# Altium schematic sheet 03_DISCRETE_LNA.SchDoc
size A3; SheetNumber: 3; SheetTotal: 6
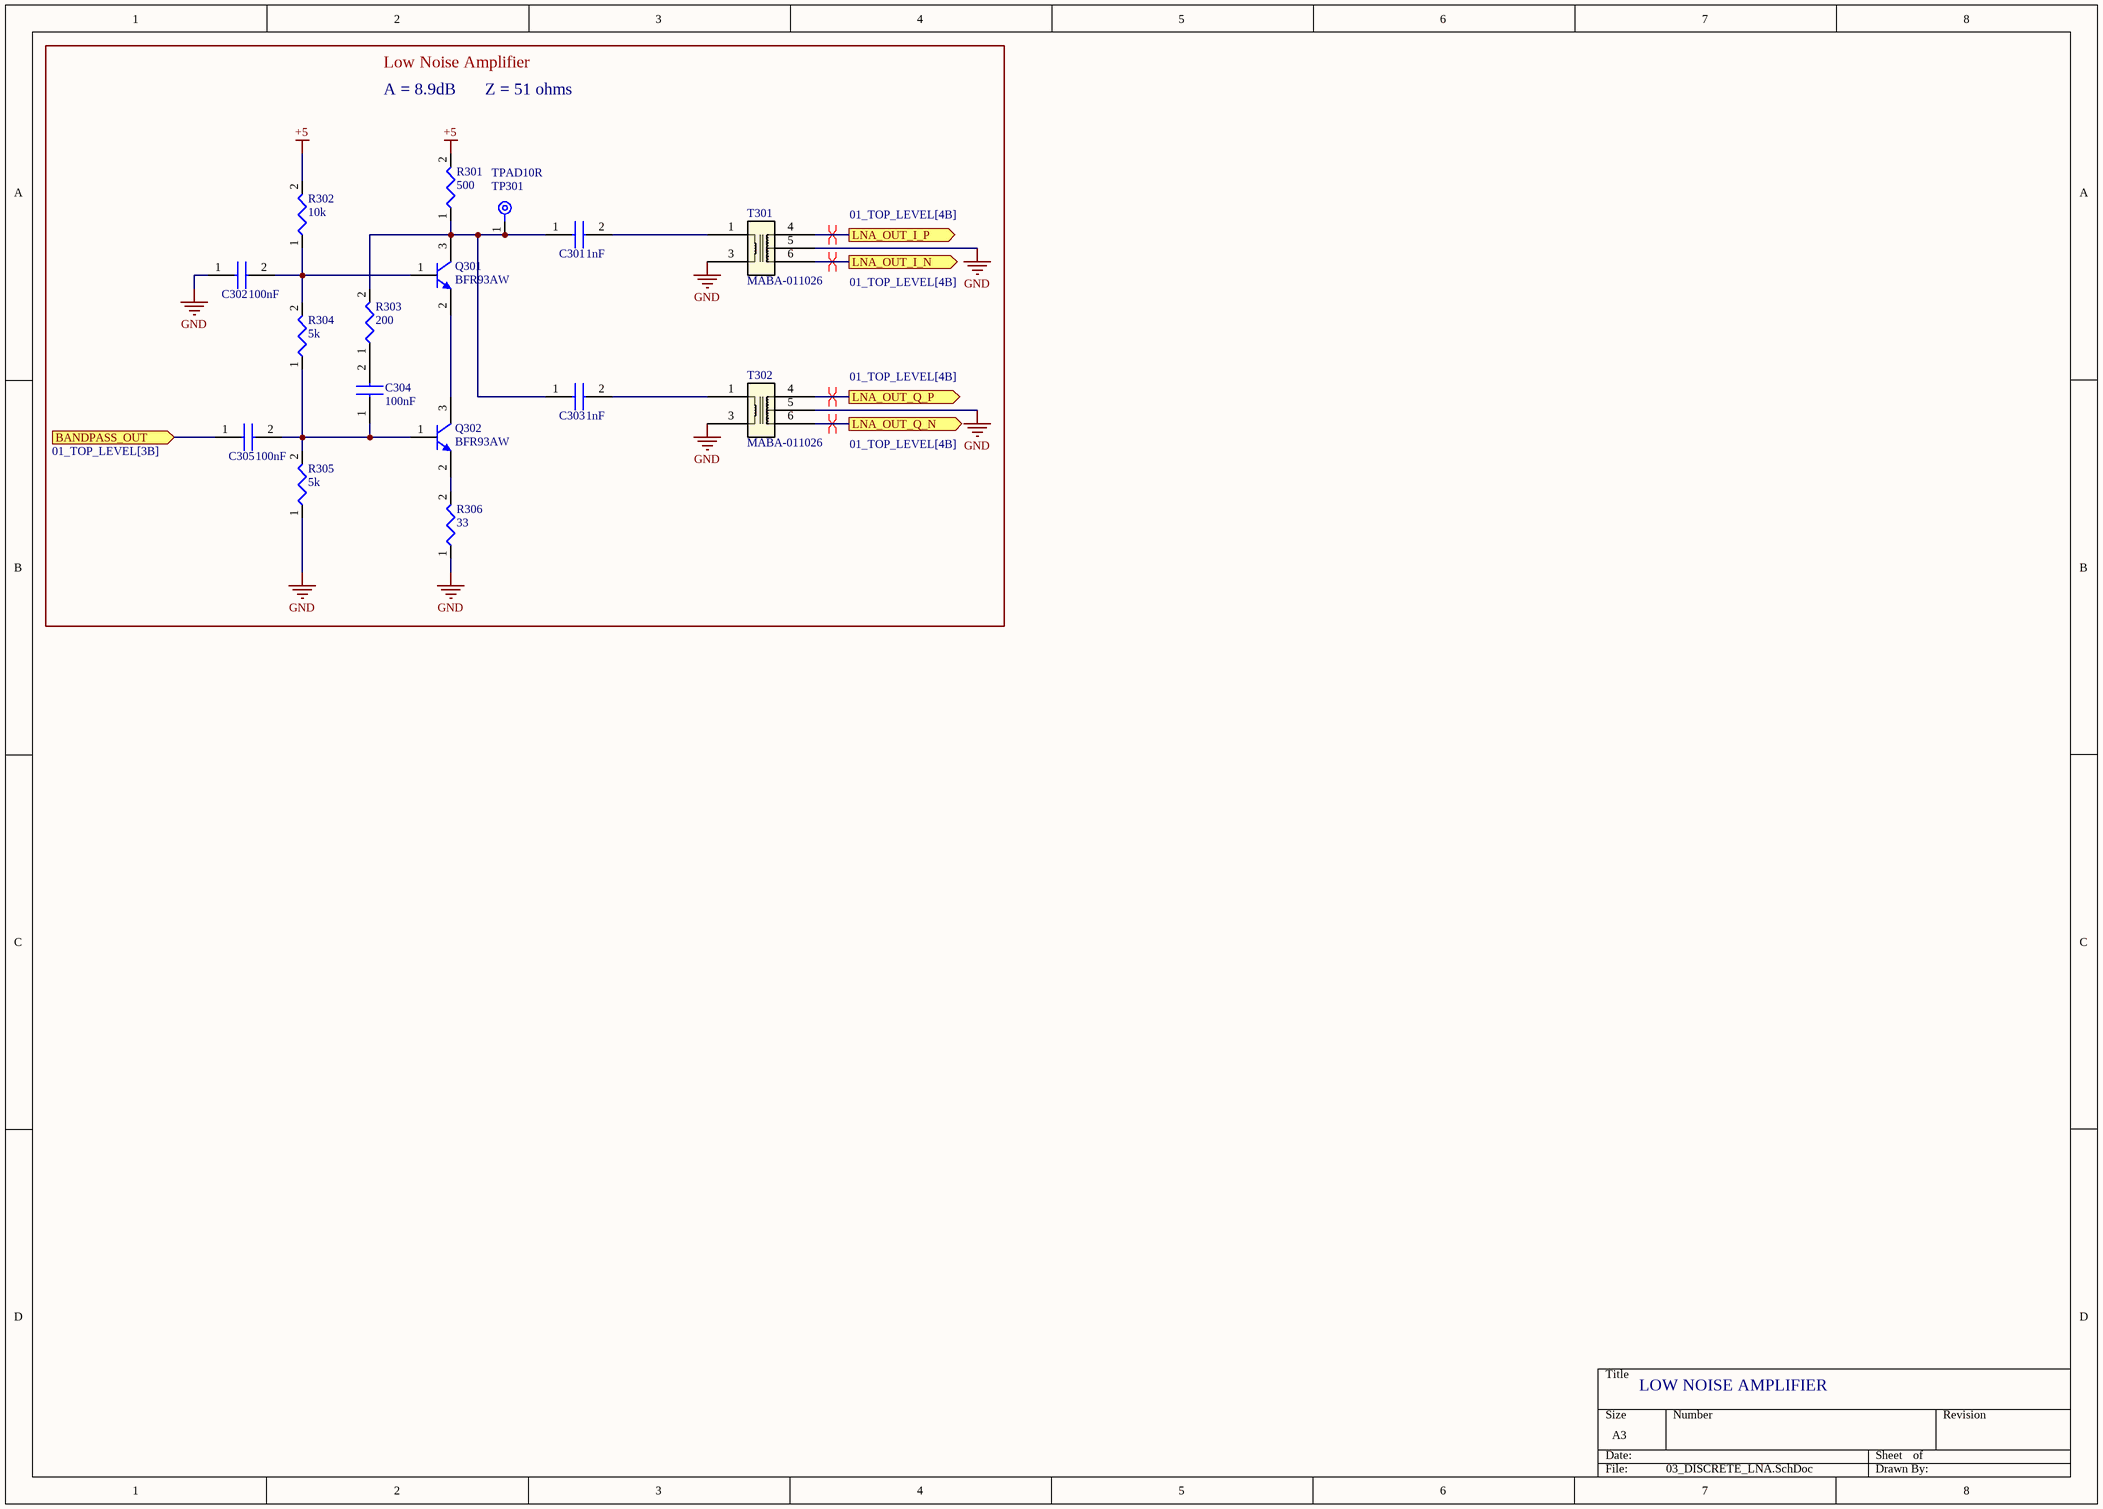
[diagram p0: 03_DISCRETE_LNA.SchDoc]

## Parts
C301  1nF  [CAP_0805]
C302  100nF  [CAP_0805]
C303  1nF  [CAP_0805]
C304  100nF  [CAP_0805]
C305  100nF  [CAP_0805]
Q301  BFR93AW  [INF-SOT323_M]
Q302  BFR93AW  [INF-SOT323_M]
R301  500  [RES_0805]
R302  10k  [RES_0805]
R303  200  [RES_0805]
R304  5k  [RES_0805]
R305  5k  [RES_0805]
R306  33  [RES_0805]
T301  MABA-011026  [MABA-011026_MCM]
T302  MABA-011026  [MABA-011026_MCM]
TP301  TPAD10R  [TEST_POINT]

## Ports
BANDPASS_OUT (in, see 01_TOP_LEVEL[3B]), LNA_OUT_I_N (out, see 01_TOP_LEVEL[4B]), LNA_OUT_I_P (out, see 01_TOP_LEVEL[4B]), LNA_OUT_Q_N (out, see 01_TOP_LEVEL[4B]), LNA_OUT_Q_P (out, see 01_TOP_LEVEL[4B])

## Nets
+5: R301.2 R302.2
GND: C302.1 R305.1 R306.1 T301.3 T301.5 T302.3 T302.5
BANDPASS_OUT: C305.1 ; port BANDPASS_OUT
LNA_OUT_I_N: T301.6 ; port LNA_OUT_I_N
LNA_OUT_I_P: T301.4 ; port LNA_OUT_I_P
LNA_OUT_Q_N: T302.6 ; port LNA_OUT_Q_N
LNA_OUT_Q_P: T302.4 ; port LNA_OUT_Q_P
NetC301_1: C301.1 C303.1 Q301.3(C) R301.1 R303.2 TP301.1
NetC301_2: C301.2 T301.1
NetC302_2: C302.2 Q301.1(B) R302.1 R304.2
NetC303_2: C303.2 T302.1
NetC304_1: C304.1 C305.2 Q302.1(B) R304.1 R305.2
NetC304_2: C304.2 R303.1
NetQ301_2: Q301.2(E) Q302.3(C)
NetQ302_2: Q302.2(E) R306.2

## Layout directives
differential pair: LNA_OUT_I_N, LNA_OUT_I_P, LNA_OUT_Q_N, LNA_OUT_Q_P

## Notes on the sheet
- Low Noise Amplifier
- A = 8.9dB
- Z = 51 ohms
- LOW NOISE AMPLIFIER

## Library data of the parts
C301-C305 = CAP_0805: Capacitor SMD 0805; Height: 0.94mm
Q301 Q302 = CMP-1189-00009-1: NPN Silicon RF Transistor, 12 V VCEO, 90 mA IC, 15.5 dB Gmax, SOT323, Green; Manufacturer: Infineon; IC (max): 90 mA; NFmin (typ): 1.5 dB; Gmax (typ): 15.5 dB; Group: For low frequencies, e.g. VHF/UHF; VCEO (max): 12 V; Ptot (max): 300mW; Green: yes; ComponentLink3Description: Package Specification; PartNumber: BFR93AW; ComponentLink2URL: http://www.infineon.com/dgdl/Infineon_LNA_BFR93AW.pdf?folderId=db3a30431400ef68011425b1354605c1&fileId=db3a30431441fb5d0114acaaec8c148f&location=en.Products.RF.RF_Transistors_.High_Linearity_Si-_and_SiGe_C-Transistors_for_use_up_to_6_GHz.DATASHEET.Infineon; ComponentLink3URL: http://www.infineon.com/dgdl/SOT323-Package_Overview.pdf?folderId=db3a30431936bc4b0119533e1dcb3c92&fileId=db3a30431936bc4b011953495f283cb1; ComponentLink2Description: Datasheet; Halogen-free: yes; ComponentLink1URL: http://www.infineon.com/; PackageReference: SOT323; PackageDescription: 3-Pin Small Outline Transistor Package, 1.25 x 2 mm Body, 0.65 mm Pitch; ComponentLink1Description: Manufacturer URL; Mounting Technology: Surface Mount; DatasheetVersion: Jul-2012; ComponentLink4Description: DigiKey; ComponentLink4URL: https://www.digikey.com/en/products/detail/infineon-technologies/BFR93AWH6327XTSA1/2337797
R301-R306 = RES_0805: Resistor SMD 0805
T301 T302 = MABA-011026: RF Transformer; Manufacturer_Name: MACOM; Frequency Range: 2MHz ~ 200MHz; Impedance: 1:1; Insertion Loss: 1.0dB; Return Loss: 12.0dB; Phase Difference: 0.5°; Copyright: Copyright (C) 2025 Ultra Librarian. All rights reserved.; Manufacturer_Part_Number: MABA-011026; Data Sheet: https://cdn.macom.com/datasheets/MABA-011026.pdf; Package: SMD; ComponentLink1Description: DigiKey; ComponentLink1URL: https://www.digikey.com/en/products/detail/macom-technology-solutions/MABA-011026/12757346
TP301 = TEST_POINT: Testpont Pad 10R